# Altium schematic sheet 1-POWER.SchDoc
size 420 x 297 mm; Engineer: Иванов; DocumentNumber: POWER; SheetNumber: 1; SheetTotal: 4
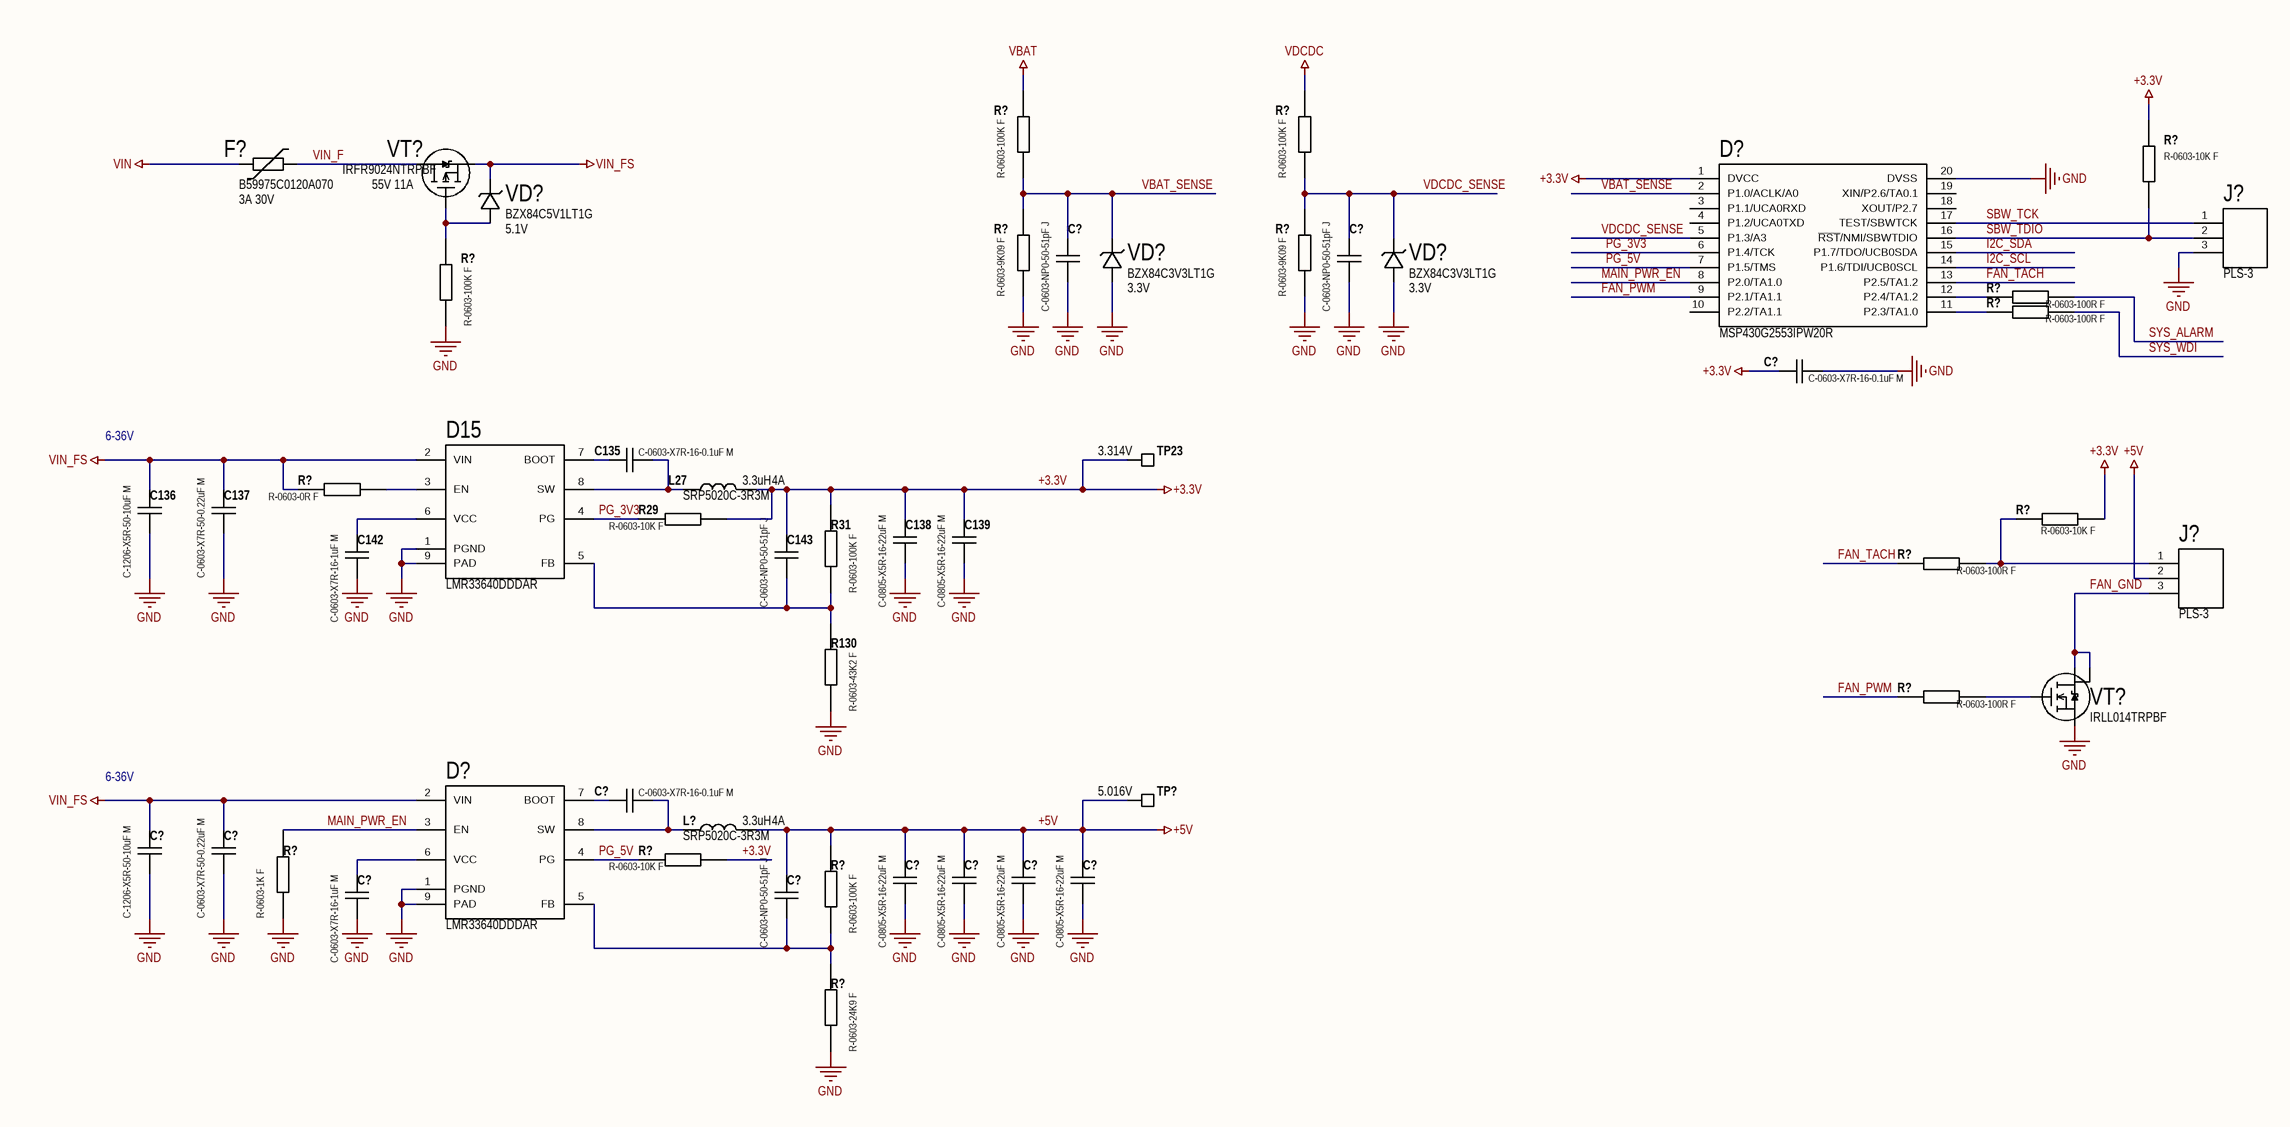
[diagram p0: 1-POWER.SchDoc]

## Parts
(Parts that share a designator on the sheet are numbered #1, #2 ... from top to bottom, then left to right.)
C135  C-0603-X7R-16-0.1uF M  [CAPC160X80X100L35N]
C136  C-1206-X5R-50-10uF M  [CAPC320X160X180L50N]
C137  C-0603-X7R-50-0.22uF M  [CAPC160X80X100L35N]
C138  C-0805-X5R-16-22uF M  [CAPC200X125X145L50N]
C139  C-0805-X5R-16-22uF M  [CAPC200X125X145L50N]
C142  C-0603-X7R-16-1uF M  [CAPC160X80X100L35N]
C143  C-0603-NP0-50-51pF J  [CAPC160X80X100L35N]
C?#1  C-0603-NP0-50-51pF J  [CAPC160X80X100L35N]
C?#2  C-0603-NP0-50-51pF J  [CAPC160X80X100L35N]
C?#3  C-0603-X7R-16-0.1uF M  [CAPC160X80X100L35N]
C?#4  C-0603-X7R-16-0.1uF M  [CAPC160X80X100L35N]
C?#5  C-1206-X5R-50-10uF M  [CAPC320X160X180L50N]
C?#6  C-0603-X7R-50-0.22uF M  [CAPC160X80X100L35N]
C?#7  C-0805-X5R-16-22uF M  [CAPC200X125X145L50N]
C?#8  C-0805-X5R-16-22uF M  [CAPC200X125X145L50N]
C?#9  C-0805-X5R-16-22uF M  [CAPC200X125X145L50N]
C?#10  C-0805-X5R-16-22uF M  [CAPC200X125X145L50N]
C?#11  C-0603-X7R-16-1uF M  [CAPC160X80X100L35N]
C?#12  C-0603-NP0-50-51pF J  [CAPC160X80X100L35N]
D15  LMR33640DDDAR  [SOIC9P127_490X600X170L83X41T490X295]
D?#1  MSP430G2553IPW20R
D?#2  LMR33640DDDAR  [SOIC9P127_490X600X170L83X41T490X295]
F?  B59975C0120A070  value 3A 30V
J?#1  PLS-3  [HDRV3W63P254_3X1_762X571H1144]
J?#2  PLS-3  [HDRV3W63P254_3X1_762X571H1144]
L27  SRP5020C-3R3M  value 3.3uH  MaxCurrent: 4A  [INDDFN2_570X520X200L110X250_srp5020c]
L?  SRP5020C-3R3M  value 3.3uH  MaxCurrent: 4A  [INDDFN2_570X520X200L110X250_srp5020c]
R29  R-0603-10K F  [RESC160X80X55L30N]
R31  R-0603-100K F  [RESC160X80X55L30N]
R130  R-0603-43K2 F  [RESC160X80X55L30N]
R?#1  R-0603-100K F  [RESC160X80X55L30N]
R?#2  R-0603-100K F  [RESC160X80X55L30N]
R?#3  R-0603-10K F  [RESC160X80X55L30N]
R?#4  R-0603-9K09 F  [RESC160X80X55L30N]
R?#5  R-0603-9K09 F  [RESC160X80X55L30N]
R?#6  R-0603-100K F  [RESC160X80X55L30N]
R?#7  R-0603-100R F  [RESC160X80X55L30N]
R?#8  R-0603-100R F  [RESC160X80X55L30N]
R?#9  R-0603-0R F  [RESC160X80X55L30N]
R?#10  R-0603-10K F  [RESC160X80X55L30N]
R?#11  R-0603-100R F  [RESC160X80X55L30N]
R?#12  R-0603-100R F  [RESC160X80X55L30N]
R?#13  R-0603-1K F  [RESC160X80X55L30N]
R?#14  R-0603-100K F  [RESC160X80X55L30N]
R?#15  R-0603-10K F  [RESC160X80X55L30N]
R?#16  R-0603-24K9 F  [RESC160X80X55L30N]
TP23  Testpoint  [TP_1x1_smd]  (value not drawn)  (no BOM)
TP?  Testpoint  [TP_1x1_smd]  (value not drawn)  (no BOM)
VD?#1  BZX84C5V1LT1G  value 5.1V  [SOT23-3]
VD?#2  BZX84C3V3LT1G  value 3.3V  [SOT23-3]
VD?#3  BZX84C3V3LT1G  value 3.3V  [SOT23-3]
VT?#1  IRFR9024NTRPBF  value 55V 11A
VT?#2  IRLL014TRPBF

## Nets
+3.3V: C138.1 C139.1 C143.1 C?#3.1 D?#1.1(DVCC) L27.2 R29.1 R31.1 R?#3.1 R?#10.2 R?#15.1 TP23.1
+5V: C?#7.1 C?#8.1 C?#9.1 C?#10.1 C?#12.1 J?#2.2 L?.2 R?#14.1 TP?.1
GND: C136.2 C137.2 C138.2 C139.2 C142.2 C?#1.2 C?#2.2 C?#3.2 C?#5.2 C?#6.2 C?#7.2 C?#8.2 C?#9.2 C?#10.2 C?#11.2 D15.1(PGND) D15.9(PAD) D?#1.20(DVSS) D?#2.1(PGND) D?#2.9(PAD) J?#1.3 R130.2 R?#4.2 R?#5.2 R?#6.2 R?#13.2 R?#16.2 VD?#2.1(A) VD?#3.1(A) VT?#2.3(S)
VBAT: R?#1.1
VDCDC: R?#2.1
VIN: F?.1
VIN_FS: C136.1 C137.1 C?#5.1 C?#6.1 D15.2(VIN) D?#2.2(VIN) R?#9.2 VD?#1.3(C) VT?#1.3(S)
FAN_GND: J?#2.3 VT?#2.2(D) VT?#2.4(D)
FAN_PWM: D?#1.9(P2.1/TA1.1) R?#12.2
FAN_TACH: D?#1.13(P2.5/TA1.2) R?#11.2
I2C_SCL: D?#1.14(P1.6/TDI/UCB0SCL)
I2C_SDA: D?#1.15(P1.7/TDO/UCB0SDA)
MAIN_PWR_EN: D?#1.8(P2.0/TA1.0) D?#2.3(EN) R?#13.1
PG_3V3: D15.4(PG) D?#1.6(P1.4/TCK) R29.2
PG_5V: D?#1.7(P1.5/TMS) D?#2.4(PG) R?#15.2
SBW_TCK: D?#1.17(TEST/SBWTCK) J?#1.1
SBW_TDIO: D?#1.16(~{RST}/NMI/SBWTDIO) J?#1.2 R?#3.2
SYS_ALARM: R?#7.1
SYS_WDI: R?#8.1
VBAT_SENSE: C?#1.1 D?#1.2(P1.0/ACLK/A0) R?#1.2 R?#4.1 VD?#2.3(C)
VDCDC_SENSE: C?#2.1 D?#1.5(P1.3/A3) R?#2.2 R?#5.1 VD?#3.3(C)
VIN_F: F?.2 VT?#1.4(D)
NetC135_1: C135.1 D15.7(BOOT)
NetC135_2: C135.2 D15.8(SW) L27.1
NetC142_1: C142.1 D15.6(VCC)
NetC143_2: C143.2 D15.5(FB) R31.2 R130.1
NetC?#4_1: C?#4.1 D?#2.7(BOOT)
NetC?#4_2: C?#4.2 D?#2.8(SW) L?.1
NetC?#11_1: C?#11.1 D?#2.6(VCC)
NetC?#12_2: C?#12.2 D?#2.5(FB) R?#14.2 R?#16.1
NetD15_3: D15.3(EN) R?#9.1
NetD?#1_11: D?#1.11(P2.3/TA1.0) R?#8.2
NetD?#1_12: D?#1.12(P2.4/TA1.2) R?#7.2
NetJ?#2_1: J?#2.1 R?#10.1 R?#11.1
NetR?#6_1: R?#6.1 VD?#1.1(A) VT?#1.1(G)
NetR?#12_1: R?#12.1 VT?#2.1(G)

Not connected (* = marked no-connect by the designer): D?#1 3(P1.1/UCA0RXD) 4(P1.2/UCA0TXD) 10(P2.2/TA1.1) 18(XOUT/P2.7) 19(XIN/P2.6/TA0.1)

## Notes on the sheet
- 6-36V
- (near TP23) 3.314V
- (near TP?) 5.016V
- Подп. и дата
- Инв.№ дубл.
- Взам.инв.№
- Подп.и дата
- Инв.№ подл.
- Изм.
- Лист
- № докум.
- Подп.
- Дата
- Копировал
- Формат  A3

## Library data of the parts
C135 C?#3 C?#4 = C: General capacitor; Manufacturer: Murata; Component_Type: Конденсатор; Mount_Type: SMD; Tolerance: 20%; Voltage: 16V; Value: 0.1uF; TC: X7R; Partnumber: *; PnP_Name: C-0603-X7R-16-0.1uF M; Size: 0603; UID: C-0603-X7R-16-0.1uF M
C136 C?#5 = C: General capacitor; Manufacturer: Samsung; Partnumber: CL31A106MBHNNNE; Component_Type: Конденсатор; Mount_Type: Auto; Tolerance: 20%; Voltage: 50V; Value: 10uF; TC: X5R; PnP_Name: C-1206-X5R-50-10uF M; Size: 1206; UID: C-1206-X5R-50-10uF M
C137 C?#6 = C: General capacitor; Manufacturer: Murata; Component_Type: Конденсатор; Mount_Type: SMD; Tolerance: 20%; Voltage: 50V; Value: 0.22uF; TC: X7R; Partnumber: *; PnP_Name: C-0603-X7R-50-0.22uF M; Size: 0603; UID: C-0603-X7R-50-0.22uF M
C138 C139 C?#7-C?#10 = C: General capacitor; Manufacturer: Murata; Component_Type: Конденсатор; Mount_Type: Auto; Tolerance: 20%; Voltage: 16V; Value: 22uF; TC: X5R; Partnumber: *; PnP_Name: C-0805-X5R-16-22uF M; Size: 0805; UID: C-0805-X5R-16-22uF M
C142 C?#11 = C: General capacitor; Manufacturer: Murata; Component_Type: Конденсатор; Mount_Type: Auto; Tolerance: 20%; Voltage: 16V; Value: 1uF; TC: X7R; Partnumber: *; PnP_Name: C-0603-X7R-16-1uF M; Size: 0603; UID: C-0603-X7R-16-1uF M
C143 C?#1 C?#2 C?#12 = C: General capacitor; Manufacturer: Murata; Component_Type: Конденсатор; Mount_Type: Auto; Tolerance: 5%; Voltage: 50V; Value: 51pF; TC: NP0; Partnumber: *; PnP_Name: C-0603-NP0-50-51pF J; Size: 0603; UID: C-0603-NP0-50-51pF J
D15 D?#2 = LMR33640: Buck Switching Regulator IC Positive Adjustable 1V 1 Output 4A; Manufacturer: Texas Instruments; Component_Type: Микросхема; Mount_Type: Auto; PnP_Name: D-LMR33640DDDAR; Partnumber: LMR33640DDDAR; UID: D-LMR33640DDDAR
D?#1 = MSP430G2553IPW20R: 16-bit microcontroller; Manufacturer: Texas Instruments; Component_Type: Микросхема; Mount_Type: Auto; PnP_Name: D-MSP430G2553IPW20R; Partnumber: MSP430G2553IPW20R; UID: D-MSP430G2553IPW20R
F? = R_T: Multifuse; Manufacturer: EPCOS; Mount_Type: Auto; Component_Type: Предохранитель; PnP_Name: F-B59975C0120A070; Partnumber: B59975C0120A070; Tolerance: -; Size: -; UID: F-B59975C0120A070; TC: -
J?#1 J?#2 = Conn_3: Manufacturer: KLS; Component_Type: Разъём; Mount_Type: Manual; Partnumber: PLS-3; UID: X-PLS-3
L27 L? = L: General inductor; Manufacturer: Bourns Inc.; Mount_Type: Auto; Component_Type: Дроссель; PnP_Name: L-SRP5020C-3R3M; Tolerance: 20%; DC Resistance: 74mOhm; Partnumber: SRP5020C-3R3M; Size: 5.7x5.2mm; UID: L-SRP5020C-3R3M
R29 R?#3 R?#10 R?#15 = R: General resistor; Manufacturer: Yageo; Mount_Type: Auto; Component_Type: Резистор; Tolerance: 1%; Value: 10k; Partnumber: *; Size: 0603; PnP_Name: R-0603-10K F; UID: R-0603-10K F
R31 R?#1 R?#2 R?#6 R?#14 = R: General resistor; Manufacturer: Yageo; Mount_Type: Auto; Component_Type: Резистор; Tolerance: 1%; Value: 100k; Partnumber: *; Size: 0603; PnP_Name: R-0603-100K F; UID: R-0603-100K F
R130 = R: General resistor; Manufacturer: Yageo; Mount_Type: Auto; Component_Type: Резистор; Tolerance: 1%; Value: 43.2k; Partnumber: *; Size: 0603; PnP_Name: R-0603-43K2 F; UID: R-0603-43K2 F
R?#4 R?#5 = R: General resistor; Manufacturer: Yageo; Mount_Type: Auto; Component_Type: Резистор; Tolerance: 1%; Value: 9.09k; Partnumber: *; Size: 0603; PnP_Name: R-0603-9K09 F; UID: R-0603-9K09 F
R?#7 R?#8 R?#11 R?#12 = R: General resistor; Manufacturer: Yageo; Mount_Type: SMD; Component_Type: Резистор; Value: 100; Partnumber: *; Tolerance: -; Size: 0603; PnP_Name: R-0603-100R F; UID: R-0603-100R F
R?#9 = R: General resistor; Manufacturer: Yageo; Mount_Type: SMD; Component_Type: Резистор; Value: 0; Partnumber: *; Tolerance: -; Size: 0603; PnP_Name: R-0603-0R F; UID: R-0603-0R F
R?#13 = R: General resistor; Manufacturer: Yageo; Mount_Type: Auto; Component_Type: Резистор; Tolerance: 1%; Value: 1k; Partnumber: *; Size: 0603; PnP_Name: R-0603-1K F; UID: R-0603-1K F
R?#16 = R: General resistor; Manufacturer: Yageo; Mount_Type: Auto; Component_Type: Резистор; Tolerance: 1%; Value: 24.9k; Partnumber: *; Size: 0603; PnP_Name: R-0603-24K9 F; UID: R-0603-24K9 F
TP23 TP? = Test_point: Test point
VD?#1 = BZX84C5V1LT1G: Zener Voltage Regulator (Diod); Manufacturer: ON Semiconductor; Component_Type: Транзистор; Mount_Type: Auto; PnP_Name: VD-BZX84C5V1LT1G; Partnumber: BZX84C5V1LT1G; UID: VD-BZX84C5V1LT1G
VD?#2 VD?#3 = BZX84C5V1LT1G: Zener Voltage Regulator (Diod); Manufacturer: ON Semiconductor; Component_Type: Транзистор; Mount_Type: Auto; PnP_Name: VD-BZX84C3V3LT1G; Partnumber: BZX84C3V3LT1G; UID: VD-BZX84C3V3LT1G
VT?#1 = IRFR9024: MOSFET P-CH 55V 11A DPAK; Manufacturer: Infineon Technologies; Component_Type: Транзистор; Mount_Type: Auto; PnP_Name: VT-IRFR9024NTRPBF; Partnumber: IRFR9024NTRPBF; UID: VT-IRFR9024NTRPBF
VT?#2 = IRLL014: Power N-MOSFET; Manufacturer: Vishay; Component_Type: Транзистор; Mount_Type: Auto; PnP_Name: VT-IRLL014TRPBF; Value: 60V 2.7A; Partnumber: IRLL014TRPBF; UID: VT-IRLL014TRPBF